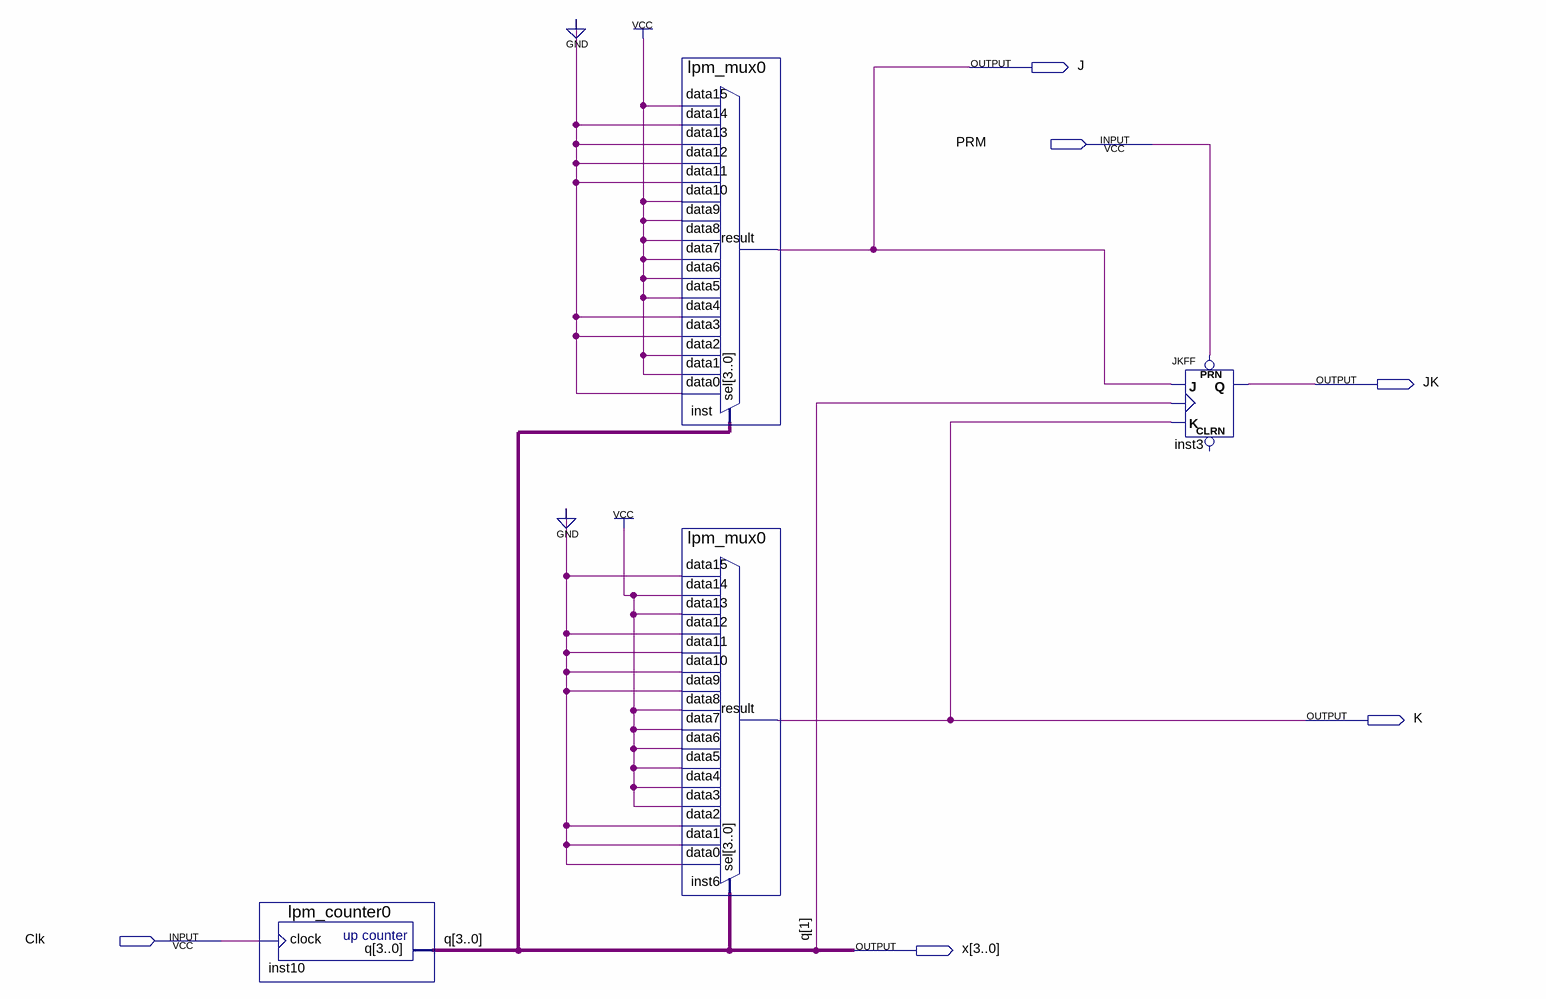
[diagram p0: schematic sheet]
// Quartus schematic JK.bdf as structural Verilog: 4 symbols, 6 pins
module JK (
  input  PRM,
  input  Clk,
  output J,
  output JK,
  output K,
  output [3:0] x
);

  lpm_counter0 inst10 (.clock(Clk), .q(x));
  lpm_mux0 inst (
    .data15(1'b1), .data14(1'b0), .data13(1'b0), .data12(1'b0), .data11(1'b0), .data10(1'b1), .data9(1'b1),
    .data8(1'b1), .data7(1'b1), .data6(1'b1), .data5(1'b1), .data4(1'b0), .data3(1'b0), .data2(1'b1),
    .data1(1'b1), .data0(1'b0), .sel(x), .result(J));
  lpm_mux0 inst6 (
    .data15(1'b0), .data14(1'b1), .data13(1'b1), .data12(1'b0), .data11(1'b0), .data10(1'b0), .data9(1'b0),
    .data8(1'b1), .data7(1'b1), .data6(1'b1), .data5(1'b1), .data4(1'b1), .data3(1'b1), .data2(1'b0),
    .data1(1'b0), .data0(1'b0), .sel(x), .result(K));
  JKFF inst3 (.PRN(PRM), .K(K), .J(J), .CLK(x[1]), .Q(JK));  // open: CLRN

  // Other names for the same wires on the sheet: q[3:0] = x
endmodule
